# Altium schematic sheet SCH-4-ESC2.SchDoc
size Letter; SheetNumber: 2
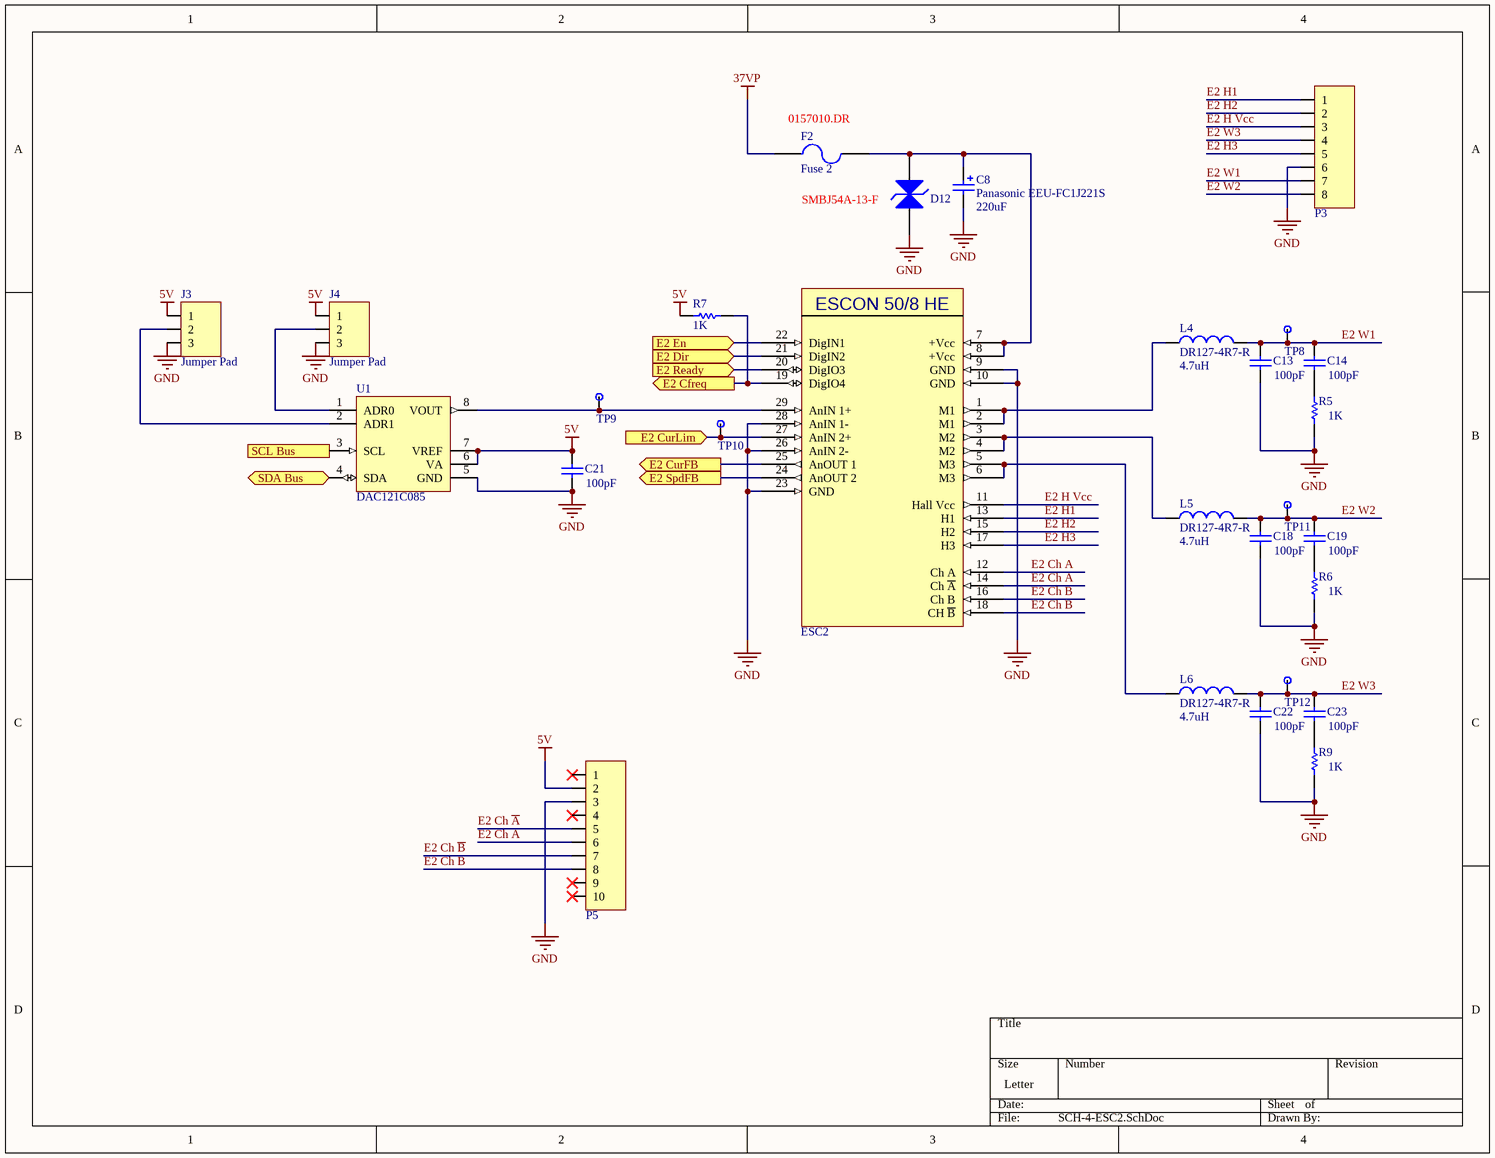
[diagram p0: SCH-4-ESC2.SchDoc]

## Parts
C8  Panasonic EEU-FC1J221S  value 220uF  [Panasonic EEU-FC1J221S]
C13  value 100pF  [C1206]  (hidden comment: Cap Semi)
C14  value 100pF  [C1206]  (hidden comment: Cap Semi)
C18  value 100pF  [C1206]  (hidden comment: Cap Semi)
C19  value 100pF  [C1206]  (hidden comment: Cap Semi)
C21  value 100pF  [C1206]  (hidden comment: Cap Semi)
C22  value 100pF  [C1206]  (hidden comment: Cap Semi)
C23  value 100pF  [C1206]  (hidden comment: Cap Semi)
D12  TVS_DIODE  [SMBJ54A-13-F]  (value not drawn)
ESC2  ESCON 50/8 HE  [ESCON 50/8 HE]  (value not drawn)
F2  Fuse 2  [0157010.DR]
J3  Jumper Pad  [3 Pad TH]
J4  Jumper Pad  [3 Pad TH]
L4  DR127-4R7-R  value 4.7uH  [DR127-4R7-R]
L5  DR127-4R7-R  value 4.7uH  [DR127-4R7-R]
L6  DR127-4R7-R  value 4.7uH  [DR127-4R7-R]
P3  Mini-Fit Jr 8 Pos  [Molex Mini-Fit Jr 0039281083]  (value not drawn)
P5  Header_10_Pos_Ribbon Male  [3M_2510-6002UB]  (value not drawn)
R5  value 1K  [RESC1608X06N_0603]  (hidden comment: Res1)
R6  value 1K  [RESC1608X06N_0603]  (hidden comment: Res1)
R7  value 1K  [RESC1608X06N_0603]  (hidden comment: Res1)
R9  value 1K  [RESC1608X06N_0603]  (hidden comment: Res1)
TP8  TestPt  [50_MIL_PAD]  (value not drawn)
TP9  TestPt  [50_MIL_PAD]  (value not drawn)
TP10  TestPt  [50_MIL_PAD]  (value not drawn)
TP11  TestPt  [50_MIL_PAD]  (value not drawn)
TP12  TestPt  [50_MIL_PAD]  (value not drawn)
U1  DAC121C085  [MUA08A_L]

## Ports
E2 Cfreq (out), E2 CurFB (out), E2 CurLim (in), E2 Dir (in), E2 En (in), E2 Ready (in), E2 SpdFB (out), SCL Bus (in), SDA Bus (bidir)

## Nets
5V: C21.2 J3.1 J4.1 P5.2 R7.2 U1.6(VA) U1.7(VREF)
37VP: F2.1
GND: C8.2 C13.1 C18.1 C21.1 C22.1 D12.1(A) ESC2.9(GND) ESC2.10(GND) ESC2.23(GND) ESC2.26(AnIN_2-) ESC2.28(AnIN_1-) J3.3 J4.3 P3.6 P5.3 R5.1 R6.1 R9.1 U1.5(GND)
E2 Cfreq: ESC2.19(DigIO4) R7.1 ; port E2 Cfreq
E2 Ch A: ESC2.12(Ch_A) P5.6
E2 Ch ~{A}: ESC2.14(Ch_~{A}) P5.5
E2 Ch B: ESC2.16(Ch_B) P5.8
E2 Ch ~{B}: ESC2.18(CH_~{B}) P5.7
E2 CurFB: ESC2.25(AnOUT_1) ; port E2 CurFB
E2 CurLim: ESC2.27(AnIN_2+) TP10.1 ; port E2 CurLim
E2 Dir: ESC2.21(DigIN2) ; port E2 Dir
E2 En: ESC2.22(DigIN1) ; port E2 En
E2 H1: ESC2.13(H1) P3.1
E2 H2: ESC2.15(H2) P3.2
E2 H3: ESC2.17(H3) P3.5
E2 H Vcc: ESC2.11(Hall_Vcc) P3.3
E2 Ready: ESC2.20(DigIO3) ; port E2 Ready
E2 SpdFB: ESC2.24(AnOUT_2) ; port E2 SpdFB
E2 W1: C13.2 C14.2 L4.2 P3.7 TP8.1
E2 W2: C18.2 C19.2 L5.2 P3.8 TP11.1
E2 W3: C22.2 C23.2 L6.2 P3.4 TP12.1
SCL Bus: U1.3(SCL) ; port SCL Bus
SDA Bus: U1.4(SDA) ; port SDA Bus
NetC8_1: C8.1 D12.2(K) ESC2.7(+Vcc) ESC2.8(+Vcc) F2.2
NetC14_1: C14.1 R5.2
NetC19_1: C19.1 R6.2
NetC23_1: C23.1 R9.2
NetESC2_1: ESC2.1(M1) ESC2.2(M1) L4.1
NetESC2_3: ESC2.3(M2) ESC2.4(M2) L5.1
NetESC2_5: ESC2.5(M3) ESC2.6(M3) L6.1
NetESC2_29: ESC2.29(AnIN_1+) TP9.1 U1.8(VOUT)
NetJ3_2: J3.2 U1.2(ADR1)
NetJ4_2: J4.2 U1.1(ADR0)

Not connected (* = marked no-connect by the designer): P5 1* 4* 9* 10*

## Notes on the sheet
- (near F2) 0157010.DR
- SMBJ54A-13-F

## Library data of the parts
C8 = Panasonic EEU-FC1J221S: Polarized Capacitor (Radial)
C13 C14 C18 C19 C21-C23 = Cap Semi: Capacitor (Semiconductor SIM Model); Published: 8-Jun-2000; LatestRevisionDate: 29-May-2009; LatestRevisionNote: IPC-7351 Footprint Added.; PackageReference: C1206; Publisher: Altium Limited; PackageDescription: Chip Capacitor
D12 = TVS_DIODE: TVS Diode; Published: 8-Jun-2000; LatestRevisionDate: 17-Jul-2002; LatestRevisionNote: Re-released for DXP Platform.; PackageVersion: Sep-1996; PackageReference: SMC; Publisher: Altium Limited; PackageDescription: DO-214-AB/SMC; 2 C-Bend Leads; Body 7.9 x 5.9 mm, inc. leads (LxW); Code_JEDEC: DO-214-AB
ESC2 = ESCON 50/8 HE: ESCON Module 50/8 HE Servocontroller
F2 = Fuse 2: Fuse; Published: 8-Jun-2000; LatestRevisionDate: 17-Jul-2002; LatestRevisionNote: Re-released for DXP Platform.; PackageReference: PIN-W2/E2.8; Publisher: Altium Limited; PackageDescription: Thru-Hole; 2 Leads
J3 J4 = 3 Pad Jump Sel
L4-L6 = DR127-4R7-R: 4.7µH Shielded Wirewound Inductor 8.25A 9.17mOhm Nonstandard; Code_IEC: 1005; Published: 8-Jun-2000; LatestRevisionDate: 29-May-2009; LatestRevisionNote: IPC-7351 Footprint Added.; PackageReference: 0402-A; Publisher: Altium Limited; PackageDescription: Chip Inductor; Code_JEITA: 0402
P3 = Molex Mini-Fit Jr 8pos Vert
P5 = Header_10_Pos_Ribbon Male: 3M_2510-6002UB
R5-R7 R9 = Res1: Resistor; Published: 8-Jun-2000; LatestRevisionDate: 17-Jul-2002; LatestRevisionNote: Re-released for DXP Platform.; PackageReference: AXIAL-0.3; Publisher: Altium Limited; PackageDescription: Axial Device, Thru-Hole; 2 Leads; 0.3 in Pin Spacing
U1 = DAC121C085: 12-Bit Micro Power Digital-to-Analog Converter with an I2C-Compatible Interface and External Reference, 8-pin Mini SOIC, Pb-Free; Manufacturer: National Semiconductor; PackageTopMarking: XTT*X90C; PowerWise: Y; CompType: D/A Converter; ComponentLink3URL: http://www.national.com/packaging/folders/mua08a.html; ComponentLink2URL: http://www.national.com/pf/DA/DAC121C085.html; Code_JEDEC: MO-187-AA; ComponentLink1URL: http://www.national.com/ds/DA/DAC121C085.pdf; RoHS: Y; PackageVersion: revF, Apr-2008; PackageDescription: MINI SOIC, .118 x .118 x .034in, 8 Lead, .0256in Pitch; PackageReference: MUA08A; PinCount: 8; DatasheetVersion: Mar-2008; ComponentLink1Description: DAC121C085 Datasheet; ComponentLink2Description: DAC121C085 Web Page; ComponentLink3Description: MUA08A Package Page; RevisionNote: Component URLs added